# EAGLE design v1 (EAGLE 9.0.1)
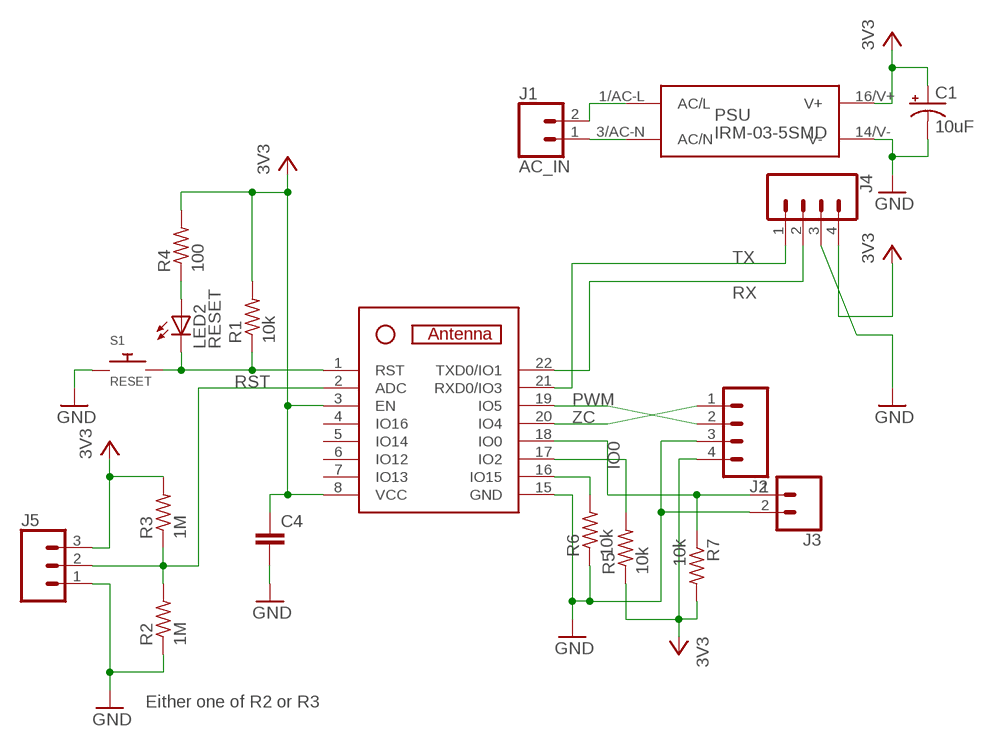
[diagram p0: schematic, sheet 1]

## Parts
C1  10uF  CPOL-US153CLV-0405  [153CLV-0405]
C4  C-EUC0805  [C0805]
J1  AC_IN  1X2_5MM_SCREW  [1X2_5MM_SCREW]
J2  CONN_04  [1X04]
J3  CONN_02  [1X02]
J4  CONN_04  [1X04]
J5  CONN_03  [1X03]
LED2  RESET  LEDSML0805  [SML0805]
PSU  IRM-03-5SMD  [IRM-03-5S]
R1  10k  R-US_R0603  [R0603]
R2  1M  R-US_R0603  [R0603]
R3  1M  R-US_R0603  [R0603]
R4  100  R-US_R0805  [R0805]
R5  10k  R-US_R0603  [R0603]
R6  10k  R-US_R0603  [R0603]
R7  10k  R-US_R0603  [R0603]
S1  RESET  BUTTONSMD  [SMD_BUTTON]
U1  ESP-07  [ESP-07]

## Nets
AC/L: J1.2 PSU.1/AC-L(AC/L)
AC/N: J1.1 PSU.3/AC-N(AC/N)
GND: C1.- C4.2 J2.3 J3.2 J4.3 J5.1 PSU.14/V-(V-) R2.1 R6.1 S1.P$1 S1.P$3 U1.15(GND)
IO0: J3.1 R7.1 U1.18(IO0)
N$1: LED2.A R4.1
N$2: R5.2 U1.17(IO2)
N$3: R6.2 U1.16(IO15)
N$5: J5.2 R2.2 R3.1 U1.2(ADC)
PWM: J2.2 U1.19(IO5)
RST: LED2.C R1.1 S1.P$2 S1.P$4 U1.1(RST)
RX: J4.2 U1.22(TXD0/IO1)
TX: J4.1 U1.21(RXD0/IO3)
VCC: C1.+ C4.1 J2.4 J4.4 J5.3 PSU.16/V+(V+) R1.2 R3.2 R4.2 R5.1 R7.2 U1.3(EN) U1.8(VCC) ; supply symbol labelled 3V3
ZC: J2.1 U1.20(IO4)
Unconnected: U1.4(IO16) U1.5(IO14) U1.6(IO12) U1.7(IO13)

## Notes on the sheet
- Either one of R2 or R3

## Library data of the parts
C1 = resistor:CPOL-US: POLARIZED CAPACITOR, American symbol
C4 = resistor:C-EU: CAPACITOR, European symbol
J1 = my_parts:1X2_5MM_SCREW
J2 J4 = SparkFun-Connectors:CONN_04: Multi connection point. Often used as Generic Header-pin footprint for 0.1 inch spaced/style header connections On any of the 0.1 inch spaced packages, you can populate with these: Break Away Headers - Straight <https://www.sparkfun.com/products/116> (PRT-00116) Break Away Male Headers - Right Angle <https://www.sparkfun.com/products/553> (PRT-00553) Female Headers <https://www.sparkfun.com/products/115> (PRT-00115) Break Away Headers - Machine Pin <https://www.sparkfun.com/products/117> (PRT-00117) Break Away Female Headers - Swiss Machine Pin <https://www.sparkfun.com/products/743> (PRT-00743) For SCREWTERMINALS and SPRING TERMINALS visit here: Screw Terimnals on SparkFun.com <https://www.sparkfun.com/search/results?term=Screw+Terminals> (5mm/3.5mm/2.54mm spacing) This device is also useful as a general connection point to wire up your design to another part of your project. Our various solder wires solder well into these plated through hole pads. Hook-Up Wire - Assortment (Stranded, 22 AWG) <https://www.sparkfun.com/products/11375> (PRT-11375) Hook-Up Wire - Assortment (Solid Core, 22 AWG) <https://www.sparkfun.com/products/11367> (PRT-11367) View the entire wire category on our website here <https://www.sparkfun.com/categories/141> Special notes: Molex polarized connector foot print use with SKU : PRT-08231 with associated crimp pins and housings. 1MM SMD Version SKU: PRT-10208; PROD_ID: CONN-09696
J3 = SparkFun-Connectors:CONN_02: Multi connection point. Often used as Generic Header-pin footprint for 0.1 inch spaced/style header connections On any of the 0.1 inch spaced packages, you can populate with these: Break Away Headers - Straight <https://www.sparkfun.com/products/116> (PRT-00116) Break Away Male Headers - Right Angle <https://www.sparkfun.com/products/553> (PRT-00553) Female Headers <https://www.sparkfun.com/products/115> (PRT-00115) Break Away Headers - Machine Pin <https://www.sparkfun.com/products/117> (PRT-00117) Break Away Female Headers - Swiss Machine Pin <https://www.sparkfun.com/products/743> (PRT-00743) For SCREWTERMINALS and SPRING TERMINALS visit here: Screw Terimnals on SparkFun.com <https://www.sparkfun.com/search/results?term=Screw+Terminals> (5mm/3.5mm/2.54mm spacing) This device is also useful as a general connection point to wire up your design to another part of your project. Our various solder wires solder well into these plated through hole pads. Hook-Up Wire - Assortment (Stranded, 22 AWG) <https://www.sparkfun.com/products/11375> (PRT-11375) Hook-Up Wire - Assortment (Solid Core, 22 AWG) <https://www.sparkfun.com/products/11367> (PRT-11367) View the entire wire category on our website here <https://www.sparkfun.com/categories/141> Special notes: Molex polarized connector foot print use with: PRT-08233 with associated crimp pins and housings. 2.54_SCREWTERM for use with PRT-10571. 3.5mm Screw Terminal footprints for PRT-08084 5mm Screw Terminal footprints for use with PRT-08432
J5 = SparkFun-Connectors:CONN_03: Multi connection point. Often used as Generic Header-pin footprint for 0.1 inch spaced/style header connections On any of the 0.1 inch spaced packages, you can populate with these: Break Away Headers - Straight <https://www.sparkfun.com/products/116> (PRT-00116) Break Away Male Headers - Right Angle <https://www.sparkfun.com/products/553> (PRT-00553) Female Headers <https://www.sparkfun.com/products/115> (PRT-00115) Break Away Headers - Machine Pin <https://www.sparkfun.com/products/117> (PRT-00117) Break Away Female Headers - Swiss Machine Pin <https://www.sparkfun.com/products/743> (PRT-00743) Stackable Header - 3 Pin (Female, 0.1") <https://www.sparkfun.com/products/13875> (PRT-13875) For SCREWTERMINALS and SPRING TERMINALS visit here: Screw Terimnals on SparkFun.com <https://www.sparkfun.com/search/results?term=Screw+Terminals> (5mm/3.5mm/2.54mm spacing) This device is also useful as a general connection point to wire up your design to another part of your project. Our various solder wires solder well into these plated through hole pads. Hook-Up Wire - Assortment (Stranded, 22 AWG) <https://www.sparkfun.com/products/11375> (PRT-11375) Hook-Up Wire - Assortment (Solid Core, 22 AWG) <https://www.sparkfun.com/products/11367> (PRT-11367) View the entire wire category on our website here <https://www.sparkfun.com/categories/141> Special notes: Molex polarized connector foot print use with SKU : PRT-08232 with associated crimp pins and housings.
LED2 = led:LED: LED OSRAM: - CHIPLED LG R971, LG N971, LY N971, LG Q971, LY Q971, LO R971, LY R971 LH N974, LH R974 LS Q976, LO Q976, LY Q976 LO Q996 - Hyper CHIPLED LW Q18S LB Q993, LB Q99A, LB R99A - SideLED LS A670, LO A670, LY A670, LG A670, LP A670 LB A673, LV A673, LT A673, LW A673 LH A674 LY A675 LS A676, LA A676, LO A676, LY A676, LW A676 LS A679, LY A679, LG A679 - Hyper Micro SIDELED® LS Y876, LA Y876, LO Y876, LY Y876 LT Y87S - SmartLED LW L88C, LW L88S LB L89C, LB L89S, LG L890 LS L89K, LO L89K, LY L89K LS L896, LA L896, LO L896, LY L896 - TOPLED LS T670, LO T670, LY T670, LG T670, LP T670 LSG T670, LSP T670, LSY T670, LOP T670, LYG T670 LG T671, LOG T671, LSG T671 LB T673, LV T673, LT T673, LW T673 LH T674 LS T676, LA T676, LO T676, LY T676, LB T676, LH T676, LSB T676, LW T676 LB T67C, LV T67C, LT T67C, LS T67K, LO T67K, LY T67K, LW E67C LS E67B, LA E67B, LO E67B, LY E67B, LB E67C, LV E67C, LT E67C LW T67C LS T679, LY T679, LG T679 LS T770, LO T770, LY T770, LG T770, LP T770 LB T773, LV T773, LT T773, LW T773 LH T774 LS E675, LA E675, LY E675, LS T675 LS T776, LA T776, LO T776, LY T776, LB T776 LHGB T686 LT T68C, LB T68C - Hyper Mini TOPLED® LB M676 - Mini TOPLED Santana® LG M470 LS M47K, LO M47K, LY M47K Source: http://www.osram.convergy.de LUXEON: - LUMILED® LXK2-PW12-R00, LXK2-PW12-S00, LXK2-PW14-U00, LXK2-PW14-V00 LXK2-PM12-R00, LXK2-PM12-S00, LXK2-PM14-U00 LXK2-PE12-Q00, LXK2-PE12-R00, LXK2-PE12-S00, LXK2-PE14-T00, LXK2-PE14-U00 LXK2-PB12-K00, LXK2-PB12-L00, LXK2-PB12-M00, LXK2-PB14-N00, LXK2-PB14-P00, LXK2-PB14-Q00 LXK2-PR12-L00, LXK2-PR12-M00, LXK2-PR14-Q00, LXK2-PR14-R00 LXK2-PD12-Q00, LXK2-PD12-R00, LXK2-PD12-S00 LXK2-PH12-R00, LXK2-PH12-S00 LXK2-PL12-P00, LXK2-PL12-Q00, LXK2-PL12-R00 Source: www.luxeon.com KINGBRIGHT: KA-3528ASYC Source: www.kingbright.com
PSU = my_parts:IRM-03-5
R1-R7 = resistor:R-US_: RESISTOR, American symbol
S1 = my_parts:BUTTON
U1 = my_parts:ESP-07

## Board
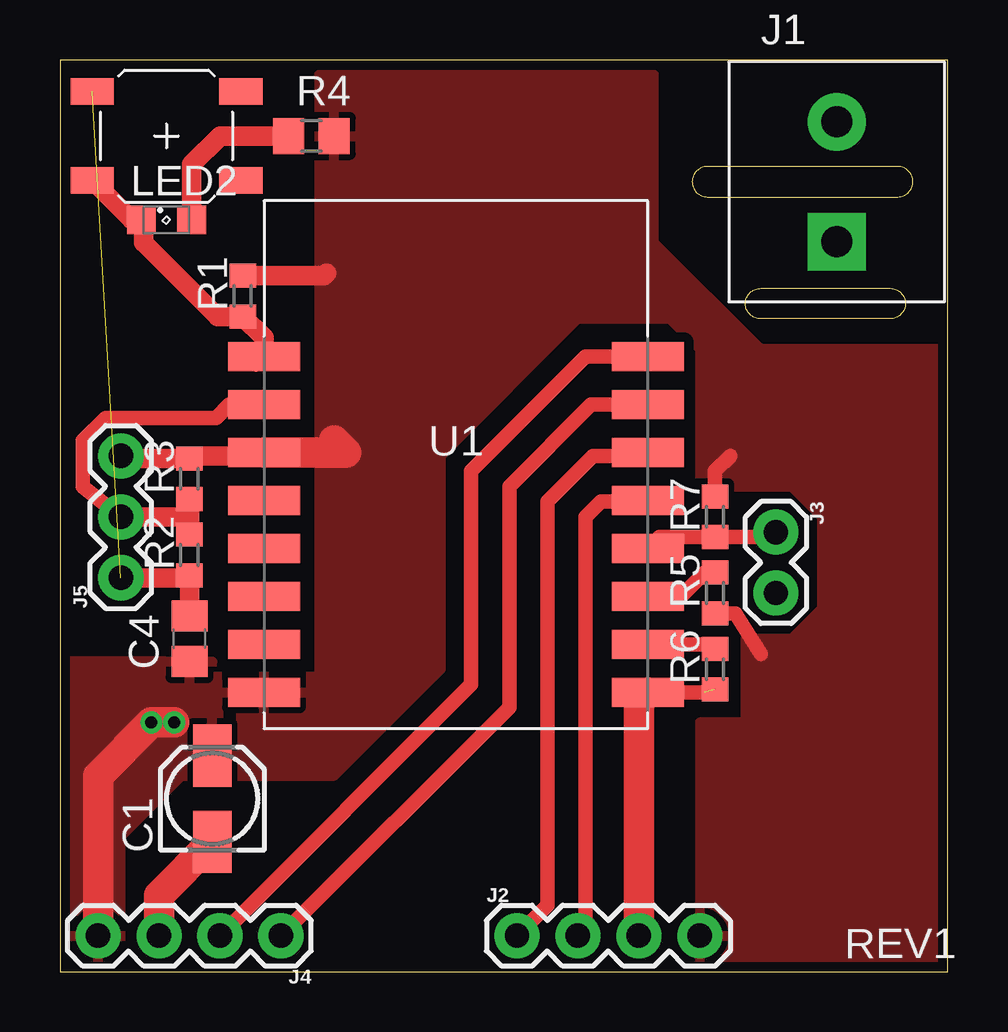
[diagram p1: board, top side]
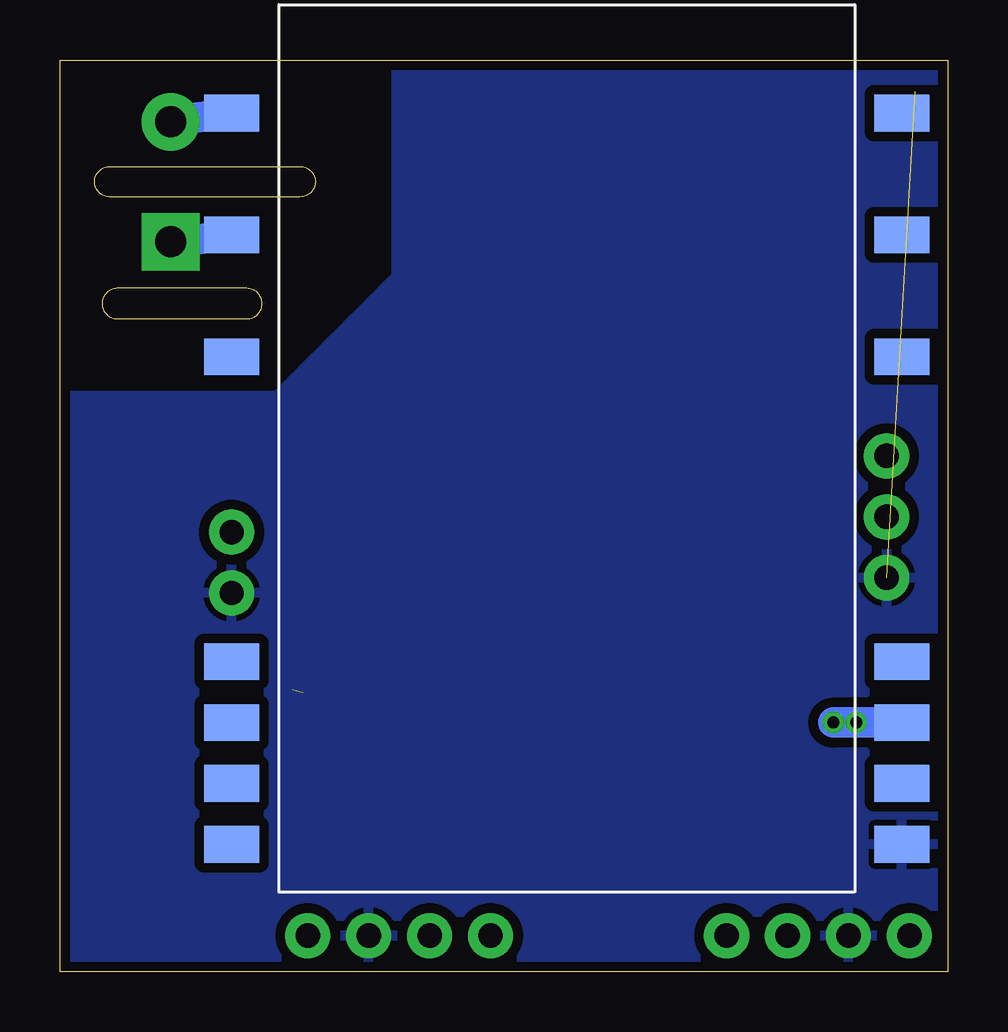
[diagram p2: board, bottom side, seen from below]

Size 37 x 38 mm. Coordinates in mm from the lower left corner, seen from the top.
Outline: 0,0 37,0 37,38 0,38 0,0
Outline: 34.92,33.56 26.99,33.56 arc180 26.99,32.29 34.92,32.29 arc180 34.92,33.56
Outline: 29.21,28.48 34.61,28.48 arc-180 34.61,27.21 29.21,27.21 arc-180 29.21,28.48
Copper layers (1*16): Top 0.035mm / dielectric 1.5mm / Bottom 0.035mm
Design rules "default *": minimum track width 6mil, minimum drill 0.35mm, track to track 6mil, track to pad 6mil, pad to pad 6mil, via to via 6mil, smd to smd 6mil, copper to edge 16mil, drill to drill 6mil, minimum pad ring 10mil, minimum via ring 8mil, stop-mask expansion 4mil, vias tented up to drill 0.6mm, thermal gap 10mil

### Footprints (pad centres in the part's own frame; a part is rotated, then mirrored left to right if it is on the bottom)
153CLV-0405 = smd 2.6 x 1.6: + 1.8,0; - -1.8,0
C0805 = smd 1.3 x 1.5: 1 -0.95,0; 2 0.95,0
1X2_5MM_SCREW = drill 1.3 pad 2.4 square: 1 2.5,0 | drill 1.3 pad 2.4: 2 -2.5,0
1X04 = drill 1.016 pad 1.88: 1 0,0; 2 2.54,0; 3 5.08,0; 4 7.62,0
1X02 = drill 1.016 pad 1.88: 1 0,0; 2 2.54,0
1X03 = drill 1.016 pad 1.88: 1 0,0; 2 2.54,0; 3 5.08,0
SML0805 = smd 1.2 x 1.2: A 1.05,0; C -1.05,0
IRM-03-5S = smd 1.524 x 2.286: 1/AC-L -13.97,-13.97; 3/AC-N -8.89,-13.97; 5 -3.81,-13.97; 10 8.89,-13.97; 11 11.43,-13.97; 12 13.97,-13.97; 13 16.51,-13.97; 14/V- 16.51,13.97; 15 13.97,13.97; 16/V+ 11.43,13.97; 17 8.89,13.97; 22 -3.81,13.97; 24 -8.89,13.97; 26 -13.97,13.97
R0603 = smd 1 x 1.1: 1 -0.85,0; 2 0.85,0
R0805 = smd 1.3 x 1.5: 1 -0.95,0; 2 0.95,0
SMD_BUTTON = smd 1.8 x 1.1: P$1 3.1,1.85; P$2 3.1,-1.85; P$3 -3.1,1.85; P$4 -3.1,-1.85
ESP-07 = smd 3 x 1.2: 1 -8,3.5; 2 -8,1.5; 3 -8,-0.5; 4 -8,-2.5; 5 -8,-4.5; 6 -8,-6.5; 7 -8,-8.5; 8 -8,-10.5; 15 8,-10.5; 16 8,-8.5; 17 8,-6.5; 18 8,-4.5; 19 8,-2.5; 20 8,-0.5; 21 8,1.5; 22 8,3.5

### Placement (x,y rotation side)
C1  6.35,7.21 90 top
C4  5.4,13.88 90 top
J1  32.38,32.92 270 top
J2  19.05,1.49 0 top
J3  29.84,18.32 270 top
J4  9.21,1.49 180 top
J5  2.54,16.41 90 top
LED2  4.45,31.34 0 top
PSU  15.88,21.81 270 bottom
R1  7.62,28.16 90 top
R2  5.4,17.37 90 top
R3  5.4,20.54 90 top
R4  10.48,34.83 0 top
R5  27.3,15.78 90 top
R6  27.3,12.61 90 top
R7  27.3,18.95 90 top
S1  4.45,34.83 0 top
U1  16.51,22.13 0 top

### Tracks (layer width: path | path; a pad name or v marks a point on that pad's centre or on a via)
AC/L
  Bottom 1.27: PSU.1/AC-L 32.34,35.47 J1.2
AC/N
  Bottom 1.27: PSU.3/AC-N 32.34,30.38 J1.1
GND  (2 unrouted)
  Top 0.61: U1.15 26.86,11.63
  Top 0.813: J5.1 4.98,16.41 R2.1 C4.2
  Top 1.27: C1.- 4.13,3.18 J4.3 | J2.3 24.13,11.25 U1.15
  pour Bottom (isolate 0.406): 0,0 0,38 23,38 23,29 28,24 37,24 37,0
IO0
  Top 0.61: 29.31,18.11 J3.1 29.63,18.11 R7.1 24.98,18.11 U1.18
N$1
  Top 0.813: LED2.A 5.5,33.66 6.67,34.83 R4.1
N$2
  Top 0.61: U1.17 25.89,15.63 26.99,16.73 27.2,16.73 R5.2
N$3
  Top 0.61: U1.16 26.81,13.63 R6.2
N$5
  Top 0.61: J5.2 0.95,20.23 0.95,22.13 1.91,23.08 6.51,23.08 7.06,23.63 U1.2
  Top 0.813: R2.2 5.4,18.95 | 5.4,18.95 R3.1 | J5.2 5.4,18.95
PWM
  Top 0.61: J2.2 21.59,1.81 21.91,2.13 21.91,18.95 22.54,19.59 24.47,19.59 U1.19
RST
  Top 0.61: 8.19,25.3 U1.1
  Top 0.813: S1.P$4 2.99,31.34 LED2.C 3.49,31.24 3.49,30.38 6.57,27.31 R1.1 8.51,26.42 U1.1
RX
  Top 0.152: 24.3,25.63 U1.22
  Top 0.61: J4.2 17.14,11.97 17.14,20.86 21.91,25.63 24.3,25.63
TX
  Top 0.61: J4.1 18.73,11.02 18.73,20.23 22.14,23.63 U1.21
VCC  (via drill 0.5)
  Top 0.61: 7.75,21.63 U1.3 | 2.64,21.39 J5.3 | 5.5,21.5 R3.2 | R7.2 27.3,20.86 27.94,21.5 | R5.1 28.16,14.93 29.21,13.24
  Top 0.813: 7.75,21.63 7.62,21.5 5.5,21.5 | R3.2 2.64,21.39 | R1.2 11.01,29.01 11.11,29.11
  Top 1.27: v4.76,10.38 v3.81,10.38 1.59,8.16 J4.4 | U1.3 11.93,21.63 11.43,22.13
  Bottom 1.27: PSU.16/V+ v3.81,10.38 v4.76,10.38
  pour Top (isolate 0.406): 2.54,-0.09 2.54,5.62 5.08,8.16 11.43,8.16 15.88,12.61 15.88,21.5 21.59,27.21 25.4,27.21 26.67,25.94 26.67,20.23 30.48,20.23 31.75,18.95 31.75,15.14 30.48,13.88 28.57,13.88 28.57,10.38 26.67,10.38 26.67,-0.09 36.83,-0.09 36.83,25.94 29.21,25.94 24.77,30.38 24.77,37.37 10.79,37.37 10.79,12.29 6.35,12.29 6.35,12.92 0,12.92 0,-0.09
ZC
  Top 0.61: U1.20 24.38,21.5 22.23,21.5 20.32,19.59 20.32,2.76 J2.1

### Text on the board
_tsilk: REV1